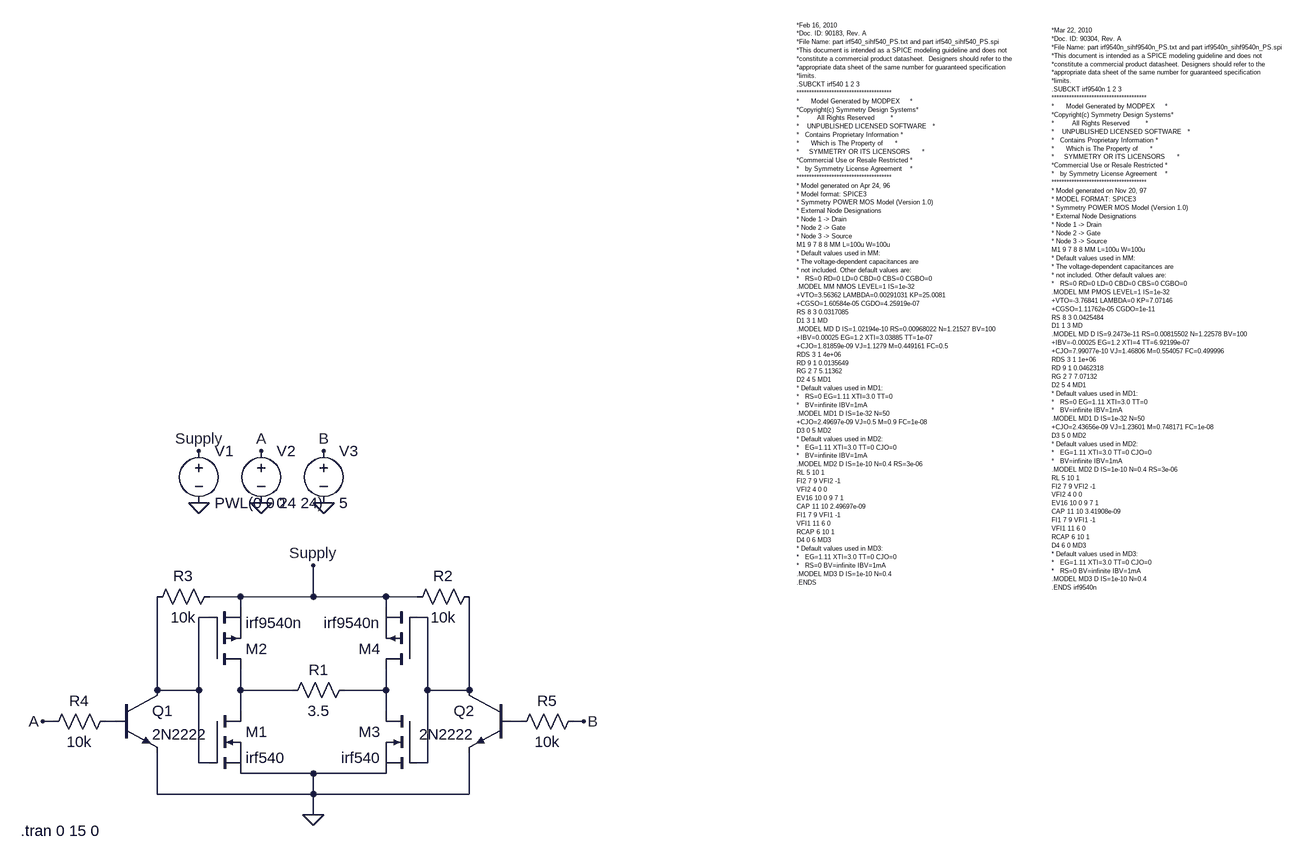
[diagram p0: schematic HBridge.asc]
HBridge.asc, the LTspice schematic file:
Version 4
SHEET 1 1912 680
WIRE 272 256 224 256
WIRE 384 256 384 208
WIRE 384 256 272 256
WIRE 496 256 384 256
WIRE 544 256 496 256
WIRE 272 272 272 256
WIRE 496 272 496 256
WIRE 224 288 208 288
WIRE 560 288 544 288
WIRE 144 400 144 256
WIRE 208 400 208 288
WIRE 208 400 144 400
WIRE 272 400 272 368
WIRE 352 400 272 400
WIRE 496 400 496 368
WIRE 496 400 432 400
WIRE 560 400 560 288
WIRE 624 400 624 256
WIRE 624 400 560 400
WIRE 272 432 272 400
WIRE 496 432 496 400
WIRE -16 448 -32 448
WIRE 80 448 64 448
WIRE 704 448 688 448
WIRE 800 448 784 448
WIRE 208 512 208 400
WIRE 224 512 208 512
WIRE 560 512 560 400
WIRE 560 512 544 512
WIRE 384 528 272 528
WIRE 496 528 384 528
WIRE 144 560 144 496
WIRE 384 560 384 528
WIRE 384 560 144 560
WIRE 624 560 624 496
WIRE 624 560 384 560
WIRE 384 592 384 560
FLAG 384 592 0
FLAG 208 112 0
FLAG 208 32 Supply
FLAG 384 208 Supply
FLAG 304 112 0
FLAG 400 112 0
FLAG 304 32 A
FLAG 400 32 B
FLAG -32 448 A
FLAG 800 448 B
SYMBOL nmos 224 432 R0
SYMATTR InstName M1
SYMATTR Value irf540
SYMATTR Prefix X
SYMBOL pmos 224 368 M180
SYMATTR InstName M2
SYMATTR Value irf9540n
SYMATTR Prefix X
SYMBOL res 448 384 R90
WINDOW 0 0 56 VBottom 2
WINDOW 3 32 56 VTop 2
SYMATTR InstName R1
SYMATTR Value 3.5
SYMBOL nmos 544 432 M0
SYMATTR InstName M3
SYMATTR Value irf540
SYMATTR Prefix X
SYMBOL pmos 544 368 R180
SYMATTR InstName M4
SYMATTR Value irf9540n
SYMATTR Prefix X
SYMBOL voltage 208 16 R0
WINDOW 123 0 0 Left 0
WINDOW 39 0 0 Left 0
SYMATTR InstName V1
SYMATTR Value PWL(0 0 24 24)
SYMBOL voltage 304 16 R0
WINDOW 123 0 0 Left 0
WINDOW 39 0 0 Left 0
SYMATTR InstName V2
SYMATTR Value 0
SYMBOL voltage 400 16 R0
WINDOW 123 0 0 Left 0
WINDOW 39 0 0 Left 0
SYMATTR InstName V3
SYMATTR Value 5
SYMBOL res 640 240 R90
WINDOW 0 0 56 VBottom 2
WINDOW 3 32 56 VTop 2
SYMATTR InstName R2
SYMATTR Value 10k
SYMBOL res 240 240 R90
WINDOW 0 0 56 VBottom 2
WINDOW 3 32 56 VTop 2
SYMATTR InstName R3
SYMATTR Value 10k
SYMBOL npn 80 400 R0
SYMATTR InstName Q1
SYMATTR Value 2N2222
SYMBOL npn 688 400 M0
SYMATTR InstName Q2
SYMATTR Value 2N2222
SYMBOL res 80 432 R90
WINDOW 0 0 56 VBottom 2
WINDOW 3 32 56 VTop 2
SYMATTR InstName R4
SYMATTR Value 10k
SYMBOL res 800 432 R90
WINDOW 0 0 56 VBottom 2
WINDOW 3 32 56 VTop 2
SYMATTR InstName R5
SYMATTR Value 10k
TEXT -66 616 Left 2 !.tran 0 15 0
TEXT 1128 -624 Left 0 !*Feb 16, 2010\n*Doc. ID: 90183, Rev. A\n*File Name: part irf540_sihf540_PS.txt and part irf540_sihf540_PS.spi\n*This document is intended as a SPICE modeling guideline and does not\n*constitute a commercial product datasheet.  Designers should refer to the\n*appropriate data sheet of the same number for guaranteed specification\n*limits.\n.SUBCKT irf540 1 2 3\n**************************************\n*      Model Generated by MODPEX     *\n*Copyright(c) Symmetry Design Systems*\n*         All Rights Reserved        *\n*    UNPUBLISHED LICENSED SOFTWARE   *\n*   Contains Proprietary Information *\n*      Which is The Property of      *\n*     SYMMETRY OR ITS LICENSORS      *\n*Commercial Use or Resale Restricted *\n*   by Symmetry License Agreement    *\n**************************************\n* Model generated on Apr 24, 96\n* Model format: SPICE3\n* Symmetry POWER MOS Model (Version 1.0)\n* External Node Designations\n* Node 1 -> Drain\n* Node 2 -> Gate\n* Node 3 -> Source\nM1 9 7 8 8 MM L=100u W=100u\n* Default values used in MM:\n* The voltage-dependent capacitances are\n* not included. Other default values are:\n*   RS=0 RD=0 LD=0 CBD=0 CBS=0 CGBO=0\n.MODEL MM NMOS LEVEL=1 IS=1e-32\n+VTO=3.56362 LAMBDA=0.00291031 KP=25.0081\n+CGSO=1.60584e-05 CGDO=4.25919e-07\nRS 8 3 0.0317085\nD1 3 1 MD\n.MODEL MD D IS=1.02194e-10 RS=0.00968022 N=1.21527 BV=100\n+IBV=0.00025 EG=1.2 XTI=3.03885 TT=1e-07\n+CJO=1.81859e-09 VJ=1.1279 M=0.449161 FC=0.5\nRDS 3 1 4e+06\nRD 9 1 0.0135649\nRG 2 7 5.11362\nD2 4 5 MD1\n* Default values used in MD1:\n*   RS=0 EG=1.11 XTI=3.0 TT=0\n*   BV=infinite IBV=1mA\n.MODEL MD1 D IS=1e-32 N=50\n+CJO=2.49697e-09 VJ=0.5 M=0.9 FC=1e-08\nD3 0 5 MD2\n* Default values used in MD2:\n*   EG=1.11 XTI=3.0 TT=0 CJO=0\n*   BV=infinite IBV=1mA\n.MODEL MD2 D IS=1e-10 N=0.4 RS=3e-06\nRL 5 10 1\nFI2 7 9 VFI2 -1\nVFI2 4 0 0\nEV16 10 0 9 7 1\nCAP 11 10 2.49697e-09\nFI1 7 9 VFI1 -1\nVFI1 11 6 0\nRCAP 6 10 1\nD4 0 6 MD3\n* Default values used in MD3:\n*   EG=1.11 XTI=3.0 TT=0 CJO=0\n*   RS=0 BV=infinite IBV=1mA\n.MODEL MD3 D IS=1e-10 N=0.4\n.ENDS
TEXT 1520 -616 Left 0 !*Mar 22, 2010\n*Doc. ID: 90304, Rev. A\n*File Name: part irf9540n_sihf9540n_PS.txt and part irf9540n_sihf9540n_PS.spi\n*This document is intended as a SPICE modeling guideline and does not\n*constitute a commercial product datasheet. Designers should refer to the\n*appropriate data sheet of the same number for guaranteed specification\n*limits.\n.SUBCKT irf9540n 1 2 3\n**************************************\n*      Model Generated by MODPEX     *\n*Copyright(c) Symmetry Design Systems*\n*         All Rights Reserved        *\n*    UNPUBLISHED LICENSED SOFTWARE   *\n*   Contains Proprietary Information *\n*      Which is The Property of      *\n*     SYMMETRY OR ITS LICENSORS      *\n*Commercial Use or Resale Restricted *\n*   by Symmetry License Agreement    *\n**************************************\n* Model generated on Nov 20, 97\n* MODEL FORMAT: SPICE3\n* Symmetry POWER MOS Model (Version 1.0)\n* External Node Designations\n* Node 1 -> Drain\n* Node 2 -> Gate\n* Node 3 -> Source\nM1 9 7 8 8 MM L=100u W=100u\n* Default values used in MM:\n* The voltage-dependent capacitances are\n* not included. Other default values are:\n*   RS=0 RD=0 LD=0 CBD=0 CBS=0 CGBO=0\n.MODEL MM PMOS LEVEL=1 IS=1e-32\n+VTO=-3.76841 LAMBDA=0 KP=7.07146\n+CGSO=1.11762e-05 CGDO=1e-11\nRS 8 3 0.0425484\nD1 1 3 MD\n.MODEL MD D IS=9.2473e-11 RS=0.00815502 N=1.22578 BV=100\n+IBV=-0.00025 EG=1.2 XTI=4 TT=6.92199e-07\n+CJO=7.99077e-10 VJ=1.46806 M=0.554057 FC=0.499996\nRDS 3 1 1e+06\nRD 9 1 0.0462318\nRG 2 7 7.07132\nD2 5 4 MD1\n* Default values used in MD1:\n*   RS=0 EG=1.11 XTI=3.0 TT=0\n*   BV=infinite IBV=1mA\n.MODEL MD1 D IS=1e-32 N=50\n+CJO=2.43656e-09 VJ=1.23601 M=0.748171 FC=1e-08\nD3 5 0 MD2\n* Default values used in MD2:\n*   EG=1.11 XTI=3.0 TT=0 CJO=0\n*   BV=infinite IBV=1mA\n.MODEL MD2 D IS=1e-10 N=0.4 RS=3e-06\nRL 5 10 1\nFI2 7 9 VFI2 -1\nVFI2 4 0 0\nEV16 10 0 9 7 1\nCAP 11 10 3.41908e-09\nFI1 7 9 VFI1 -1\nVFI1 11 6 0\nRCAP 6 10 1\nD4 6 0 MD3\n* Default values used in MD3:\n*   EG=1.11 XTI=3.0 TT=0 CJO=0\n*   RS=0 BV=infinite IBV=1mA\n.MODEL MD3 D IS=1e-10 N=0.4\n.ENDS irf9540n

The netlist it stands for:
* HBridge.asc
XM1 N003 N001 0 irf540  ; pins D G S
XM2 N003 N001 Supply irf9540n  ; pins D G S
R1 N004 N003 3.5
XM3 N004 N002 0 irf540  ; pins D G S
XM4 N004 N002 Supply irf9540n  ; pins D G S
V1 Supply 0 PWL(0 0 24 24)
V2 A 0 0
V3 B 0 5
R2 N002 Supply 10k
R3 Supply N001 10k
Q1 N001 N005 0 0 2N2222
Q2 N002 N006 0 0 2N2222
R4 N005 A 10k
R5 B N006 10k
.model NPN NPN
.model PNP PNP
.lib standard.bjt
.tran 0 15 0
*Feb 16, 2010
*Doc. ID: 90183, Rev. A
*File Name: part irf540_sihf540_PS.txt and part irf540_sihf540_PS.spi
*This document is intended as a SPICE modeling guideline and does not
*constitute a commercial product datasheet.  Designers should refer to the
*appropriate data sheet of the same number for guaranteed specification
*limits.
.SUBCKT irf540 1 2 3
**************************************
*      Model Generated by MODPEX     *
*Copyright(c) Symmetry Design Systems*
*         All Rights Reserved        *
*    UNPUBLISHED LICENSED SOFTWARE   *
*   Contains Proprietary Information *
*      Which is The Property of      *
*     SYMMETRY OR ITS LICENSORS      *
*Commercial Use or Resale Restricted *
*   by Symmetry License Agreement    *
**************************************
* Model generated on Apr 24, 96
* Model format: SPICE3
* Symmetry POWER MOS Model (Version 1.0)
* External Node Designations
* Node 1 -> Drain
* Node 2 -> Gate
* Node 3 -> Source
M1 9 7 8 8 MM L=100u W=100u
* Default values used in MM:
* The voltage-dependent capacitances are
* not included. Other default values are:
*   RS=0 RD=0 LD=0 CBD=0 CBS=0 CGBO=0
.MODEL MM NMOS LEVEL=1 IS=1e-32
+VTO=3.56362 LAMBDA=0.00291031 KP=25.0081
+CGSO=1.60584e-05 CGDO=4.25919e-07
RS 8 3 0.0317085
D1 3 1 MD
.MODEL MD D IS=1.02194e-10 RS=0.00968022 N=1.21527 BV=100
+IBV=0.00025 EG=1.2 XTI=3.03885 TT=1e-07
+CJO=1.81859e-09 VJ=1.1279 M=0.449161 FC=0.5
RDS 3 1 4e+06
RD 9 1 0.0135649
RG 2 7 5.11362
D2 4 5 MD1
* Default values used in MD1:
*   RS=0 EG=1.11 XTI=3.0 TT=0
*   BV=infinite IBV=1mA
.MODEL MD1 D IS=1e-32 N=50
+CJO=2.49697e-09 VJ=0.5 M=0.9 FC=1e-08
D3 0 5 MD2
* Default values used in MD2:
*   EG=1.11 XTI=3.0 TT=0 CJO=0
*   BV=infinite IBV=1mA
.MODEL MD2 D IS=1e-10 N=0.4 RS=3e-06
RL 5 10 1
FI2 7 9 VFI2 -1
VFI2 4 0 0
EV16 10 0 9 7 1
CAP 11 10 2.49697e-09
FI1 7 9 VFI1 -1
VFI1 11 6 0
RCAP 6 10 1
D4 0 6 MD3
* Default values used in MD3:
*   EG=1.11 XTI=3.0 TT=0 CJO=0
*   RS=0 BV=infinite IBV=1mA
.MODEL MD3 D IS=1e-10 N=0.4
.ENDS
*Mar 22, 2010
*Doc. ID: 90304, Rev. A
*File Name: part irf9540n_sihf9540n_PS.txt and part irf9540n_sihf9540n_PS.spi
*This document is intended as a SPICE modeling guideline and does not
*constitute a commercial product datasheet. Designers should refer to the
*appropriate data sheet of the same number for guaranteed specification
*limits.
.SUBCKT irf9540n 1 2 3
**************************************
*      Model Generated by MODPEX     *
*Copyright(c) Symmetry Design Systems*
*         All Rights Reserved        *
*    UNPUBLISHED LICENSED SOFTWARE   *
*   Contains Proprietary Information *
*      Which is The Property of      *
*     SYMMETRY OR ITS LICENSORS      *
*Commercial Use or Resale Restricted *
*   by Symmetry License Agreement    *
**************************************
* Model generated on Nov 20, 97
* MODEL FORMAT: SPICE3
* Symmetry POWER MOS Model (Version 1.0)
* External Node Designations
* Node 1 -> Drain
* Node 2 -> Gate
* Node 3 -> Source
M1 9 7 8 8 MM L=100u W=100u
* Default values used in MM:
* The voltage-dependent capacitances are
* not included. Other default values are:
*   RS=0 RD=0 LD=0 CBD=0 CBS=0 CGBO=0
.MODEL MM PMOS LEVEL=1 IS=1e-32
+VTO=-3.76841 LAMBDA=0 KP=7.07146
+CGSO=1.11762e-05 CGDO=1e-11
RS 8 3 0.0425484
D1 1 3 MD
.MODEL MD D IS=9.2473e-11 RS=0.00815502 N=1.22578 BV=100
+IBV=-0.00025 EG=1.2 XTI=4 TT=6.92199e-07
+CJO=7.99077e-10 VJ=1.46806 M=0.554057 FC=0.499996
RDS 3 1 1e+06
RD 9 1 0.0462318
RG 2 7 7.07132
D2 5 4 MD1
* Default values used in MD1:
*   RS=0 EG=1.11 XTI=3.0 TT=0
*   BV=infinite IBV=1mA
.MODEL MD1 D IS=1e-32 N=50
+CJO=2.43656e-09 VJ=1.23601 M=0.748171 FC=1e-08
D3 5 0 MD2
* Default values used in MD2:
*   EG=1.11 XTI=3.0 TT=0 CJO=0
*   BV=infinite IBV=1mA
.MODEL MD2 D IS=1e-10 N=0.4 RS=3e-06
RL 5 10 1
FI2 7 9 VFI2 -1
VFI2 4 0 0
EV16 10 0 9 7 1
CAP 11 10 3.41908e-09
FI1 7 9 VFI1 -1
VFI1 11 6 0
RCAP 6 10 1
D4 6 0 MD3
* Default values used in MD3:
*   EG=1.11 XTI=3.0 TT=0 CJO=0
*   RS=0 BV=infinite IBV=1mA
.MODEL MD3 D IS=1e-10 N=0.4
.ENDS irf9540n
.backanno
.end